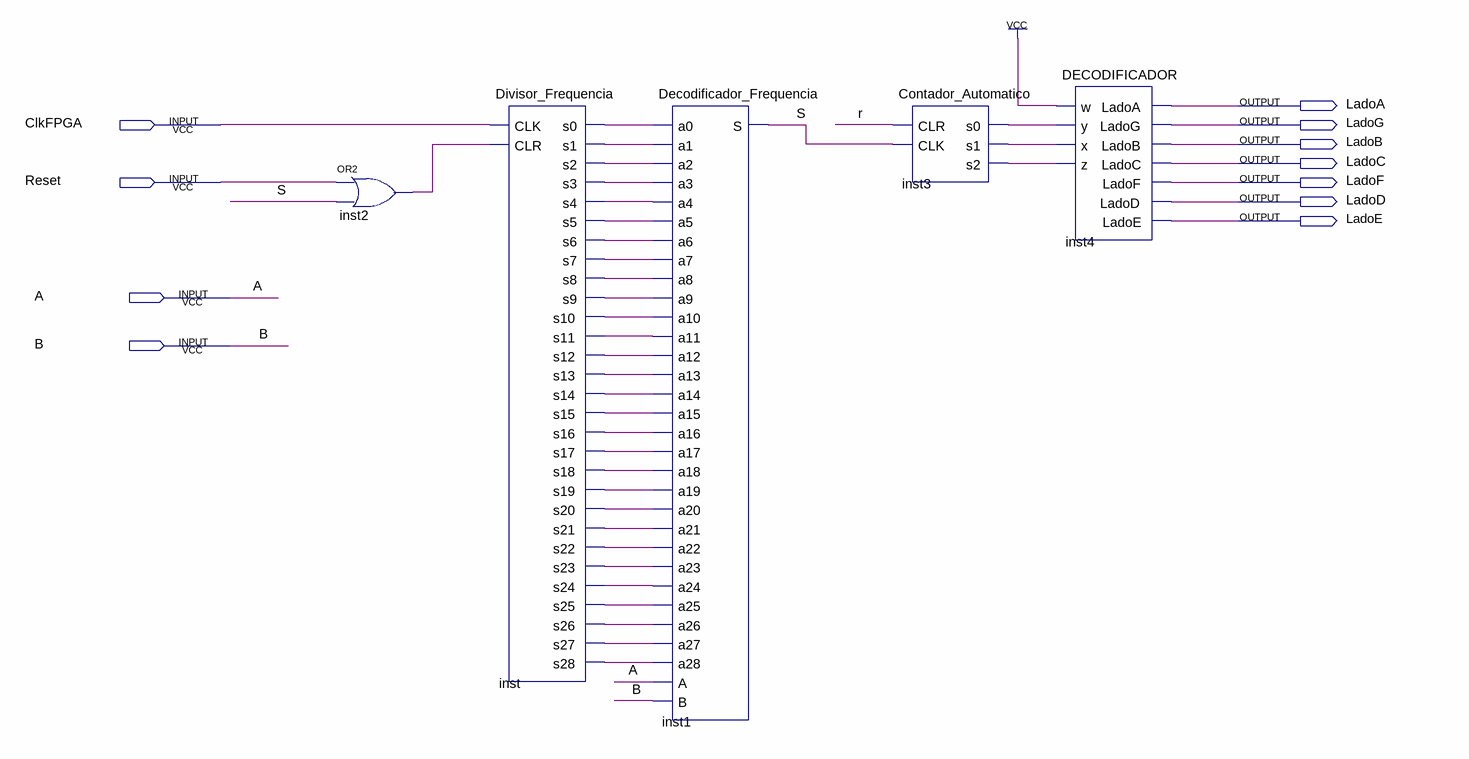
[diagram p0: schematic sheet]
// Quartus schematic Projeto2.bdf as structural Verilog: 5 symbols, 11 pins
module Projeto2 (
  input  ClkFPGA,
  input  Reset,
  input  A,
  input  B,
  output LadoA,
  output LadoG,
  output LadoB,
  output LadoC,
  output LadoF,
  output LadoD,
  output LadoE
);

  wire inst2_out, inst3_s0, inst3_s1, inst3_s2, inst_s0, inst_s1, inst_s2, inst_s3, inst_s4, inst_s5,
       inst_s6, inst_s7, inst_s8, inst_s9, inst_s10, inst_s11, inst_s12, inst_s13, inst_s14, inst_s15,
       inst_s16, inst_s17, inst_s18, inst_s19, inst_s20, inst_s21, inst_s22, inst_s23, inst_s24, inst_s25,
       inst_s26, inst_s27, inst_s28, r, S;

  or inst2 (inst2_out, Reset, S);
  Divisor_Frequencia inst (
    .CLK(ClkFPGA), .CLR(inst2_out), .s0(inst_s0), .s1(inst_s1), .s2(inst_s2), .s3(inst_s3), .s4(inst_s4),
    .s5(inst_s5), .s6(inst_s6), .s7(inst_s7), .s8(inst_s8), .s9(inst_s9), .s10(inst_s10), .s11(inst_s11),
    .s12(inst_s12), .s13(inst_s13), .s14(inst_s14), .s15(inst_s15), .s16(inst_s16), .s17(inst_s17),
    .s18(inst_s18), .s19(inst_s19), .s20(inst_s20), .s21(inst_s21), .s22(inst_s22), .s23(inst_s23),
    .s24(inst_s24), .s25(inst_s25), .s26(inst_s26), .s27(inst_s27), .s28(inst_s28));
  Decodificador_Frequencia inst1 (
    .a0(inst_s0), .a1(inst_s1), .a2(inst_s2), .a3(inst_s3), .a4(inst_s4), .a5(inst_s5), .a6(inst_s6),
    .a7(inst_s7), .a8(inst_s8), .a9(inst_s9), .a10(inst_s10), .a11(inst_s11), .a12(inst_s12), .a13(inst_s13),
    .a14(inst_s14), .a15(inst_s15), .a16(inst_s16), .a17(inst_s17), .a18(inst_s18), .a19(inst_s19),
    .a20(inst_s20), .a21(inst_s21), .a22(inst_s22), .a23(inst_s23), .a24(inst_s24), .a25(inst_s25),
    .a26(inst_s26), .a27(inst_s27), .a28(inst_s28), .A(A), .B(B), .S(S));
  Contador_Automatico inst3 (.CLR(r), .CLK(S), .s0(inst3_s0), .s1(inst3_s1), .s2(inst3_s2));
  DECODIFICADOR inst4 (
    .w(1'b1), .y(inst3_s0), .x(inst3_s1), .z(inst3_s2), .LadoA(LadoA), .LadoG(LadoG), .LadoB(LadoB),
    .LadoC(LadoC), .LadoF(LadoF), .LadoD(LadoD), .LadoE(LadoE));
endmodule
